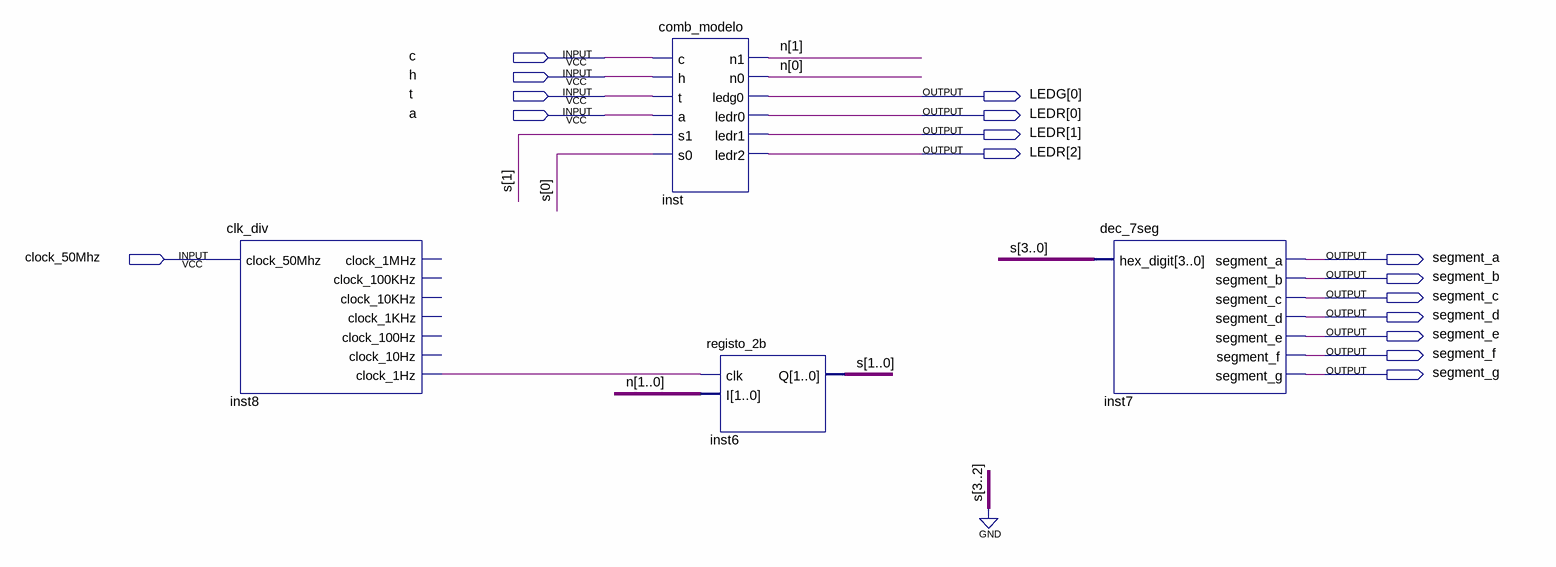
[diagram p0: schematic sheet]
// Quartus schematic controlador.bdf as structural Verilog: 4 symbols, 16 pins
module controlador (
  input  c,
  input  h,
  input  t,
  input  a,
  input  clock_50Mhz,
  output [0:0] LEDG,
  output [2:0] LEDR,
  output segment_a,
  output segment_b,
  output segment_c,
  output segment_d,
  output segment_e,
  output segment_f,
  output segment_g
);

  wire inst8_clock_1hz;
  wire [1:0] n, s;

  clk_div inst8 (
    .clock_50Mhz(clock_50Mhz), .clock_1Hz(inst8_clock_1hz));  // open: clock_1MHz, clock_100KHz, clock_10KHz, clock_1KHz, clock_100Hz, clock_10Hz
  comb_modelo inst (
    .c(c), .h(h), .t(t), .a(a), .s1(s[1]), .s0(s[0]), .n1(n[1]), .n0(n[0]), .ledg0(LEDG[0]), .ledr0(LEDR[0]),
    .ledr1(LEDR[1]), .ledr2(LEDR[2]));
  registo_2b inst6 (.clk(inst8_clock_1hz), .I(n), .Q(s));
  dec_7seg inst7 (
    .hex_digit({2'b00, s}), .segment_a(segment_a), .segment_b(segment_b), .segment_c(segment_c),
    .segment_d(segment_d), .segment_e(segment_e), .segment_f(segment_f), .segment_g(segment_g));
endmodule
